# EAGLE design esp8266_esp01_shim_rev1 (EAGLE 6.5.0)
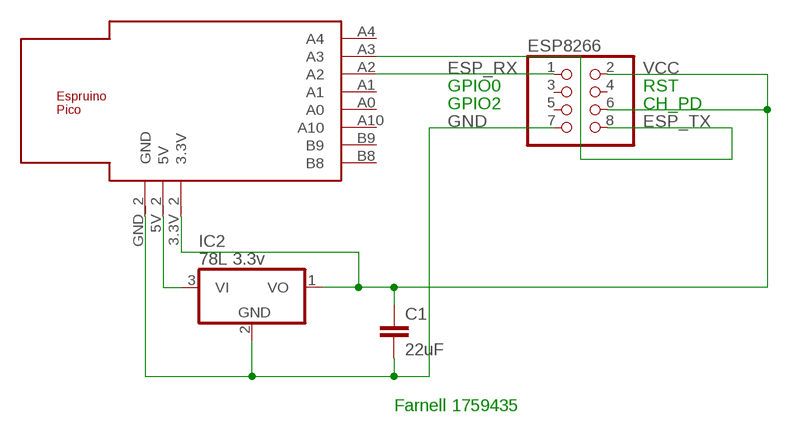
[diagram p0: schematic, sheet 1]

## Parts
C1  22uF  C-EUC1210  [C1210]
ESP8266  PINHD-2X4  [2X04]
IC2  78L 3.3v  78L05Z  [TO92]
U$1  ESPRUINO_PICO_0.05  [ESPRUINO_PICO_0.05]

## Nets
ESP_RX: ESP8266.1 U$1.A2
ESP_TX: ESP8266.8 U$1.A3
GND: C1.2 ESP8266.7 IC2.2(GND) U$1.GND_2(GND)
N$1: IC2.3(VI) U$1.5V_2(5V)
VCC: C1.1 ESP8266.2 ESP8266.6 IC2.1(VO) U$1.3.3V_2(3.3V)
Unconnected: ESP8266.3 ESP8266.4 ESP8266.5 U$1.A0 U$1.A1 U$1.A4 U$1.A10 U$1.B8 U$1.B9

## Notes on the sheet
- GPIO0 | RST
- GPIO2 | CH_PD
- Farnell 1759435

## Library data of the parts
C1 = rcl:C-EU: CAPACITOR, European symbol
ESP8266 = pinhead:PINHD-2X4: PIN HEADER
IC2 = linear:78*: Positive VOLTAGE REGULATOR Source: http://cache.national.com/ds/LM/LM78L05.pdf http://www.fairchildsemi.com/ds/LM/LM7805.pdf
U$1 = espruino_pico:ESPRUINO_PICO_0.05

## Net classes
0 default: width 0.305 mm

## Board
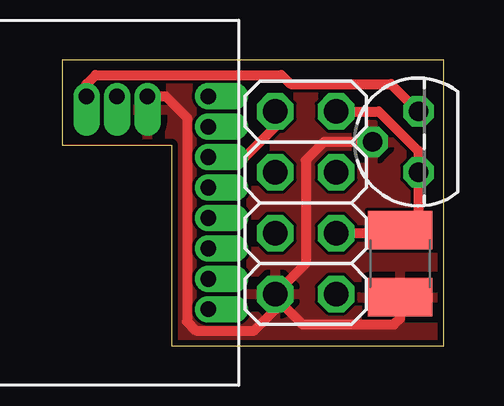
[diagram p1: board, top side]
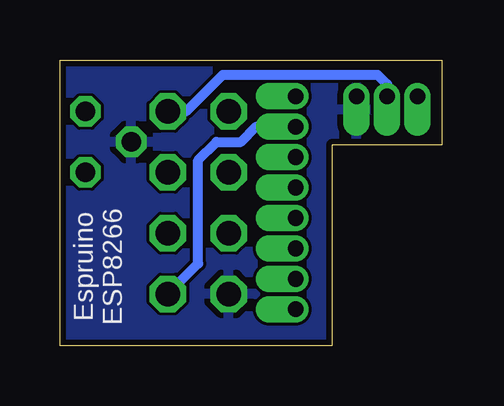
[diagram p2: board, bottom side, seen from below]

Size 15.93 x 11.93 mm. Coordinates in mm from the lower left corner, seen from the top.
Outline: 4.57,0 15.93,0 15.93,11.93 0,11.93 0,8.38 4.57,8.38 4.57,0
Copper layers (1*16): Top 0.035mm / dielectric 1.5mm / Bottom 0.035mm
Design rules "dirt_cheap_dirty_boards.v1 *": minimum track width 5mil, minimum drill 12mil, track to track 5mil, track to pad 5mil, pad to pad 5mil, via to via 5mil, smd to smd 0mil, copper to edge 10mil, drill to drill 10mil, minimum pad ring 9mil, minimum via ring 6mil, stop-mask expansion 2mil, vias tented up to drill 25mil, thermal gap 10mil

### Footprints (pad centres in the part's own frame; a part is rotated, then mirrored left to right if it is on the bottom)
C1210 = smd 1.6 x 2.7: 1 -1.4,0; 2 1.4,0
2X04 = drill 1.016 octagon: 1 -3.81,-1.27; 2 -3.81,1.27; 3 -1.27,-1.27; 4 -1.27,1.27; 5 1.27,-1.27; 6 1.27,1.27; 7 3.81,-1.27; 8 3.81,1.27
TO92 = drill 0.813 octagon: 1 -1.27,0; 2 0,1.905; 3 1.27,0
ESPRUINO_PICO_0.05 = drill 0.65 pad 0.965 offset: 3.3V_2 2.54,4.445; 5V_2 1.27,4.445; A0 6.35,-0.635; A1 6.35,0.635; A2 6.35,1.905; A3 6.35,3.175; A4 6.35,4.445; A10 6.35,-1.905; B8 6.35,-4.445; B9 6.35,-3.175; GND_2 3.81,4.445

### Placement (x,y rotation side)
C1  14.1,3.43 270 top
ESP8266  10.16,5.97 270 top
IC2  14.86,8.51 90 top
U$1  -0.25,5.97 0 top

### Tracks (layer width: path | path; a pad name or v marks a point on that pad's centre or on a via)
ESP_RX
  Top 0.406: U$1.A2 7.62,7.87 8.89,9.14 ESP8266.1
ESP_TX
  Bottom 0.406: ESP8266.8 10.16,3.43 10.16,7.75 9.4,8.51 8.38,8.51 7.75,9.14 U$1.A3
GND
  Top 0.406: ESP8266.7 8.89,2.03 10.03,0.89 13.84,0.89 14.1,1.14 C1.2 | IC2.2 10.92,8.51 10.16,7.75 10.16,3.43 ESP8266.7 | U$1.GND_2 4.32,10.41 5.21,9.53 5.21,1.02 5.59,0.64 8,0.64 8.89,1.52 ESP8266.7
  pour Bottom: -1.27,12.7 16.51,12.7 16.51,-1.27 -1.27,-1.27
  pour Top: -1.27,12.7 16.51,12.7 16.51,-1.27 -1.27,-1.27
N$1
  Top 0.406: U$1.5V_2 1.02,10.92 1.4,11.3 9.14,11.3 9.53,10.92 13.72,10.92 IC2.3
VCC
  Top 0.406: ESP8266.6 14.09,4.7 C1.1 14.86,5.46 IC2.1 14.86,8.13 13.21,9.78 ESP8266.2
  Bottom 0.406: U$1.3.3V_2 2.29,10.92 2.67,11.3 9.14,11.3 10.67,9.78 ESP8266.2

### Text on the board
bNames: Espruino / ESP8266